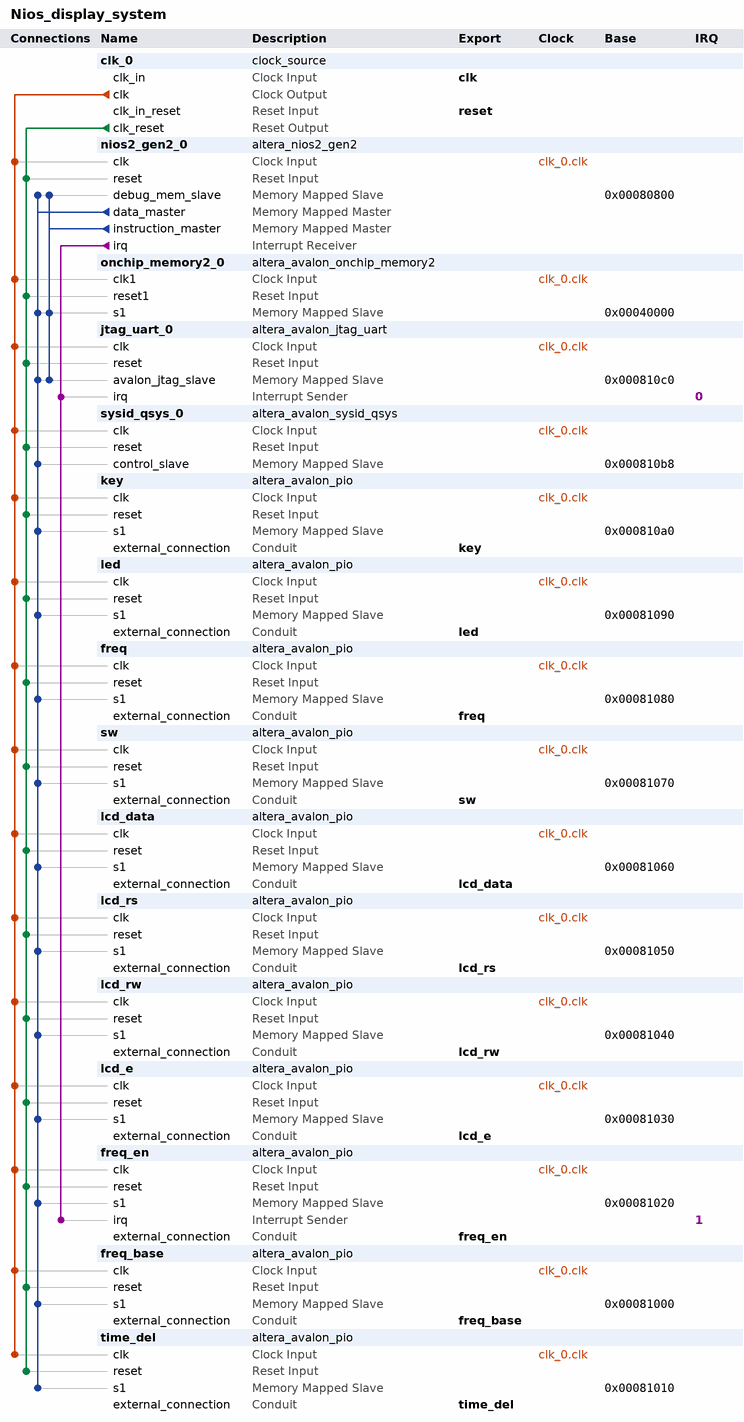
[diagram p0: system contents]
# Platform Designer (Qsys) system Nios_display_system, Cyclone V 5CSEMA4U23C6
# Parameters at their usual value, and those the tool derives, are not listed.
package require -exact qsys 16.0
create_system Nios_display_system
set_project_property DEVICE_FAMILY {Cyclone V}
set_project_property DEVICE 5CSEMA4U23C6

add_instance clk_0 clock_source 16.0
set_instance_parameter_value clk_0 clockFrequency 100000000

add_instance nios2_gen2_0 altera_nios2_gen2 16.0
set_instance_parameter_value nios2_gen2_0 dcache_size 2048
set_instance_parameter_value nios2_gen2_0 exceptionSlave onchip_memory2_0.s1
set_instance_parameter_value nios2_gen2_0 icache_size 4096
set_instance_parameter_value nios2_gen2_0 impl Fast
set_instance_parameter_value nios2_gen2_0 resetSlave onchip_memory2_0.s1

add_instance onchip_memory2_0 altera_avalon_onchip_memory2 16.0
set_instance_parameter_value onchip_memory2_0 dataWidth 32
set_instance_parameter_value onchip_memory2_0 dualPort false
set_instance_parameter_value onchip_memory2_0 initMemContent true
set_instance_parameter_value onchip_memory2_0 initializationFileName onchip_mem.hex
set_instance_parameter_value onchip_memory2_0 memorySize 200000

add_instance jtag_uart_0 altera_avalon_jtag_uart 16.0
set_instance_parameter_value jtag_uart_0 simInteractiveOptions NO_INTERACTIVE_WINDOWS

add_instance sysid_qsys_0 altera_avalon_sysid_qsys 16.0
set_instance_parameter_value sysid_qsys_0 id 1

add_instance key altera_avalon_pio 16.0
set_instance_parameter_value key direction Input
set_instance_parameter_value key width 1

add_instance led altera_avalon_pio 16.0
set_instance_parameter_value led direction Output
set_instance_parameter_value led width 8

add_instance freq altera_avalon_pio 16.0
set_instance_parameter_value freq direction Input
set_instance_parameter_value freq width 32

add_instance sw altera_avalon_pio 16.0
set_instance_parameter_value sw direction Input
set_instance_parameter_value sw edgeType ANY
set_instance_parameter_value sw width 4

add_instance lcd_data altera_avalon_pio 16.0
set_instance_parameter_value lcd_data direction Bidir
set_instance_parameter_value lcd_data width 8

add_instance lcd_rs altera_avalon_pio 16.0
set_instance_parameter_value lcd_rs direction Output
set_instance_parameter_value lcd_rs width 1

add_instance lcd_rw altera_avalon_pio 16.0
set_instance_parameter_value lcd_rw direction Output
set_instance_parameter_value lcd_rw width 1

add_instance lcd_e altera_avalon_pio 16.0
set_instance_parameter_value lcd_e direction Output
set_instance_parameter_value lcd_e width 1

add_instance freq_en altera_avalon_pio 16.0
set_instance_parameter_value freq_en captureEdge true
set_instance_parameter_value freq_en direction Input
set_instance_parameter_value freq_en edgeType ANY
set_instance_parameter_value freq_en generateIRQ true
set_instance_parameter_value freq_en irqType EDGE
set_instance_parameter_value freq_en width 1

add_instance freq_base altera_avalon_pio 16.0
set_instance_parameter_value freq_base direction Output
set_instance_parameter_value freq_base width 32

add_instance time_del altera_avalon_pio 16.0
set_instance_parameter_value time_del direction Output
set_instance_parameter_value time_del width 32

# connections
add_connection clk_0.clk freq.clk clock
add_connection clk_0.clk freq_base.clk clock
add_connection clk_0.clk freq_en.clk clock
add_connection clk_0.clk jtag_uart_0.clk clock
add_connection clk_0.clk key.clk clock
add_connection clk_0.clk lcd_data.clk clock
add_connection clk_0.clk lcd_e.clk clock
add_connection clk_0.clk lcd_rs.clk clock
add_connection clk_0.clk lcd_rw.clk clock
add_connection clk_0.clk led.clk clock
add_connection clk_0.clk nios2_gen2_0.clk clock
add_connection clk_0.clk onchip_memory2_0.clk1 clock
add_connection clk_0.clk sw.clk clock
add_connection clk_0.clk sysid_qsys_0.clk clock
add_connection clk_0.clk time_del.clk clock
add_connection clk_0.clk_reset freq.reset reset
add_connection clk_0.clk_reset freq_base.reset reset
add_connection clk_0.clk_reset freq_en.reset reset
add_connection clk_0.clk_reset jtag_uart_0.reset reset
add_connection clk_0.clk_reset key.reset reset
add_connection clk_0.clk_reset lcd_data.reset reset
add_connection clk_0.clk_reset lcd_e.reset reset
add_connection clk_0.clk_reset lcd_rs.reset reset
add_connection clk_0.clk_reset lcd_rw.reset reset
add_connection clk_0.clk_reset led.reset reset
add_connection clk_0.clk_reset nios2_gen2_0.reset reset
add_connection clk_0.clk_reset onchip_memory2_0.reset1 reset
add_connection clk_0.clk_reset sw.reset reset
add_connection clk_0.clk_reset sysid_qsys_0.reset reset
add_connection clk_0.clk_reset time_del.reset reset
add_connection nios2_gen2_0.data_master freq.s1 avalon
set_connection_parameter_value nios2_gen2_0.data_master/freq.s1 baseAddress 0x00081080
add_connection nios2_gen2_0.data_master freq_base.s1 avalon
set_connection_parameter_value nios2_gen2_0.data_master/freq_base.s1 baseAddress 0x00081000
add_connection nios2_gen2_0.data_master freq_en.s1 avalon
set_connection_parameter_value nios2_gen2_0.data_master/freq_en.s1 baseAddress 0x00081020
add_connection nios2_gen2_0.data_master jtag_uart_0.avalon_jtag_slave avalon
set_connection_parameter_value nios2_gen2_0.data_master/jtag_uart_0.avalon_jtag_slave baseAddress 0x000810c0
add_connection nios2_gen2_0.data_master key.s1 avalon
set_connection_parameter_value nios2_gen2_0.data_master/key.s1 baseAddress 0x000810a0
add_connection nios2_gen2_0.data_master lcd_data.s1 avalon
set_connection_parameter_value nios2_gen2_0.data_master/lcd_data.s1 baseAddress 0x00081060
add_connection nios2_gen2_0.data_master lcd_e.s1 avalon
set_connection_parameter_value nios2_gen2_0.data_master/lcd_e.s1 baseAddress 0x00081030
add_connection nios2_gen2_0.data_master lcd_rs.s1 avalon
set_connection_parameter_value nios2_gen2_0.data_master/lcd_rs.s1 baseAddress 0x00081050
add_connection nios2_gen2_0.data_master lcd_rw.s1 avalon
set_connection_parameter_value nios2_gen2_0.data_master/lcd_rw.s1 baseAddress 0x00081040
add_connection nios2_gen2_0.data_master led.s1 avalon
set_connection_parameter_value nios2_gen2_0.data_master/led.s1 baseAddress 0x00081090
add_connection nios2_gen2_0.data_master nios2_gen2_0.debug_mem_slave avalon
set_connection_parameter_value nios2_gen2_0.data_master/nios2_gen2_0.debug_mem_slave baseAddress 0x00080800
add_connection nios2_gen2_0.data_master onchip_memory2_0.s1 avalon
set_connection_parameter_value nios2_gen2_0.data_master/onchip_memory2_0.s1 baseAddress 0x00040000
add_connection nios2_gen2_0.data_master sw.s1 avalon
set_connection_parameter_value nios2_gen2_0.data_master/sw.s1 baseAddress 0x00081070
add_connection nios2_gen2_0.data_master sysid_qsys_0.control_slave avalon
set_connection_parameter_value nios2_gen2_0.data_master/sysid_qsys_0.control_slave baseAddress 0x000810b8
add_connection nios2_gen2_0.data_master time_del.s1 avalon
set_connection_parameter_value nios2_gen2_0.data_master/time_del.s1 baseAddress 0x00081010
add_connection nios2_gen2_0.instruction_master jtag_uart_0.avalon_jtag_slave avalon
set_connection_parameter_value nios2_gen2_0.instruction_master/jtag_uart_0.avalon_jtag_slave baseAddress 0x000810c0
add_connection nios2_gen2_0.instruction_master nios2_gen2_0.debug_mem_slave avalon
set_connection_parameter_value nios2_gen2_0.instruction_master/nios2_gen2_0.debug_mem_slave baseAddress 0x00080800
add_connection nios2_gen2_0.instruction_master onchip_memory2_0.s1 avalon
set_connection_parameter_value nios2_gen2_0.instruction_master/onchip_memory2_0.s1 baseAddress 0x00040000
add_connection nios2_gen2_0.irq freq_en.irq interrupt
set_connection_parameter_value nios2_gen2_0.irq/freq_en.irq irqNumber 1
add_connection nios2_gen2_0.irq jtag_uart_0.irq interrupt
set_connection_parameter_value nios2_gen2_0.irq/jtag_uart_0.irq irqNumber 0

# exported interfaces
add_interface clk clock sink
set_interface_property clk EXPORT_OF clk_0.clk_in
add_interface freq conduit end
set_interface_property freq EXPORT_OF freq.external_connection
add_interface freq_base conduit end
set_interface_property freq_base EXPORT_OF freq_base.external_connection
add_interface freq_en conduit end
set_interface_property freq_en EXPORT_OF freq_en.external_connection
add_interface key conduit end
set_interface_property key EXPORT_OF key.external_connection
add_interface lcd_data conduit end
set_interface_property lcd_data EXPORT_OF lcd_data.external_connection
add_interface lcd_e conduit end
set_interface_property lcd_e EXPORT_OF lcd_e.external_connection
add_interface lcd_rs conduit end
set_interface_property lcd_rs EXPORT_OF lcd_rs.external_connection
add_interface lcd_rw conduit end
set_interface_property lcd_rw EXPORT_OF lcd_rw.external_connection
add_interface led conduit end
set_interface_property led EXPORT_OF led.external_connection
add_interface reset reset sink
set_interface_property reset EXPORT_OF clk_0.clk_in_reset
add_interface sw conduit end
set_interface_property sw EXPORT_OF sw.external_connection
add_interface time_del conduit end
set_interface_property time_del EXPORT_OF time_del.external_connection

set_interconnect_requirement {$system} qsys_mm.clockCrossingAdapter HANDSHAKE
set_interconnect_requirement {$system} qsys_mm.enableEccProtection FALSE
set_interconnect_requirement {$system} qsys_mm.insertDefaultSlave FALSE
set_interconnect_requirement {$system} qsys_mm.maxAdditionalLatency 1

save_system Nios_display_system.qsys
